# EasyEDA schematic C172-XPNDR-shématics.json
TITLE: Sheet_1; REV: 1.0; Date: 2021-01-01; Sheet: 1/1; Company: Your Company
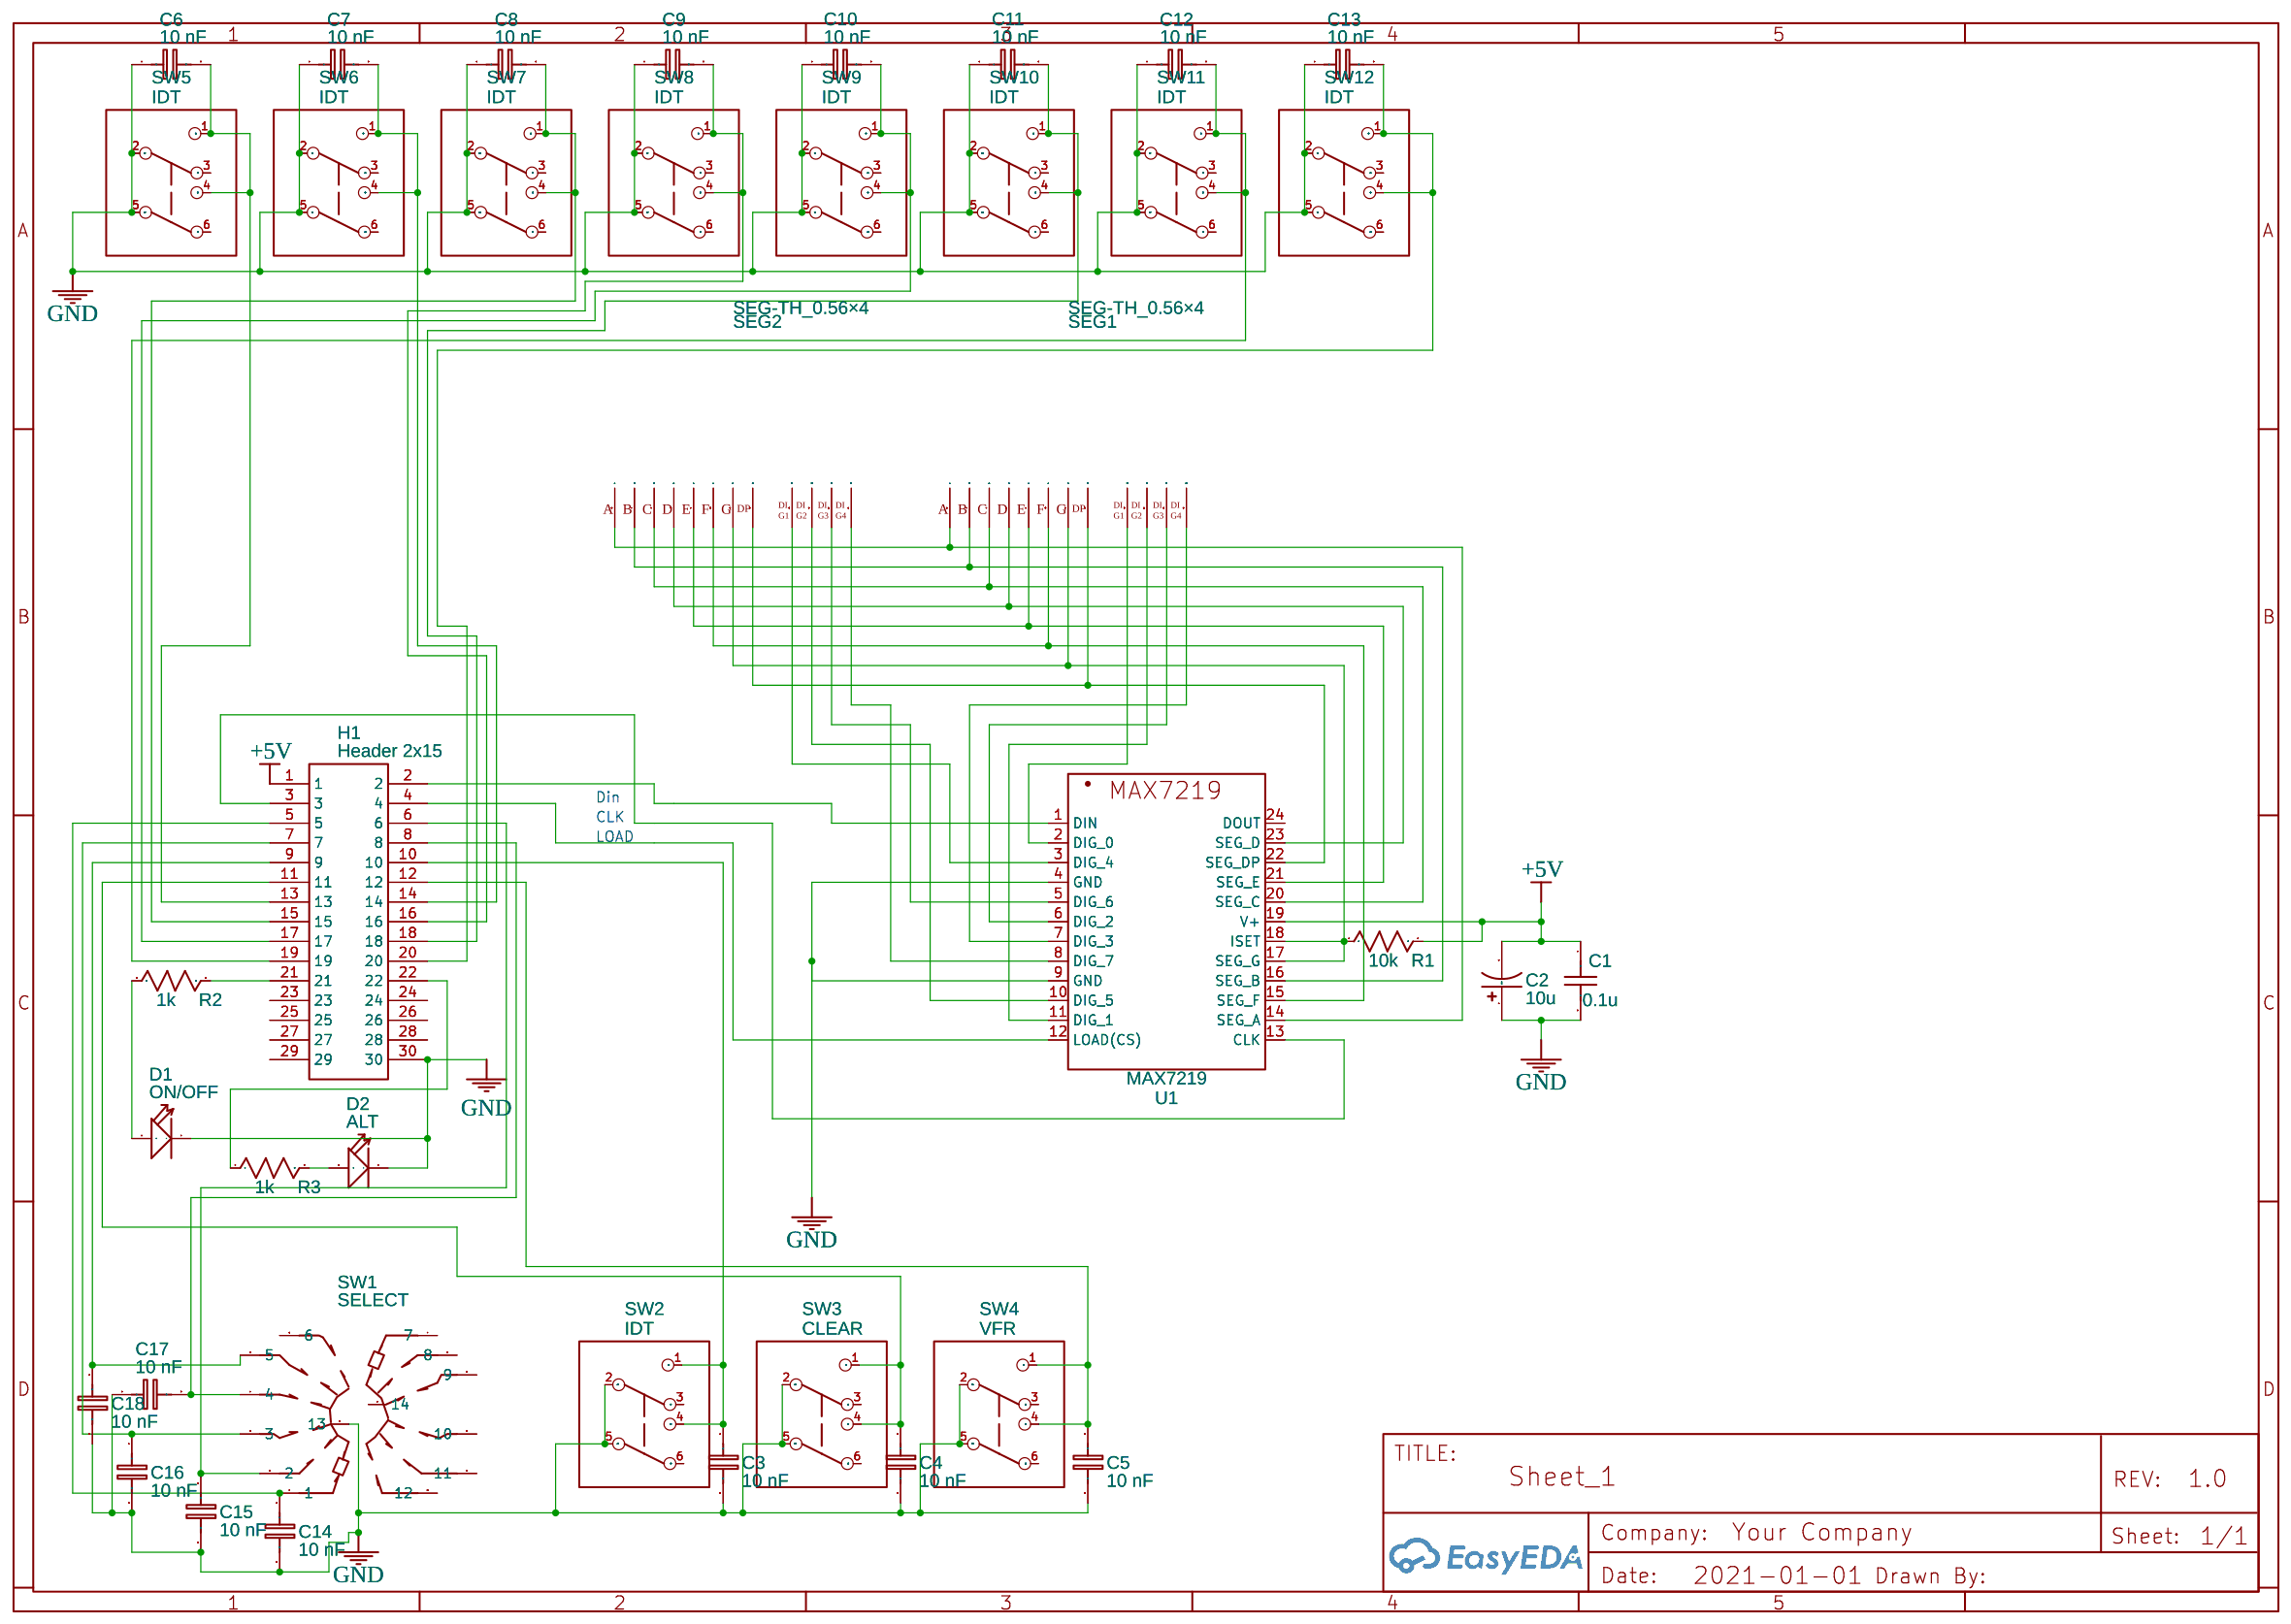
[diagram p0: schematic sheet]

## Parts
C1  0.1u  [CONDENSATEUR]
C2  10u  [CONDENSATEUR]
C3  10 nF  [RAD-0.1]
C4  10 nF  [RAD-0.1]
C5  10 nF  [RAD-0.1]
C6  10 nF  [RAD-0.1]
C7  10 nF  [RAD-0.1]
C8  10 nF  [RAD-0.1]
C9  10 nF  [RAD-0.1]
C10  10 nF  [RAD-0.1]
C11  10 nF  [RAD-0.1]
C12  10 nF  [RAD-0.1]
C13  10 nF  [RAD-0.1]
C14  10 nF  [RAD-0.1]
C15  10 nF  [RAD-0.1]
C16  10 nF  [RAD-0.1]
C17  10 nF  [RAD-0.1]
C18  10 nF  [RAD-0.1]
D1  ON/OFF  [LED2-2.54-D3.0MM]
D2  ALT  [LED2-2.54-D3.0MM]
H1  Header 2x15  [HDR-M-2.54_2X15]
R1  10k  [RESISTANCE]
R2  1k  [RESISTANCE]
R3  1k  [RESISTANCE]
SEG1  SEG-TH_0.56×4  [LED-SEG-TH_12P-L30.0-W14.0-P2.54-S10.16-BL]
SEG2  SEG-TH_0.56×4  [LED-SEG-TH_12P-L30.0-W14.0-P2.54-S10.16-BL]
SW1  SELECT  [LORLIN 2P6T SWITCH]
SW2  IDT  [SW_PUSH_BUTTON_MINI_7X7MM]
SW3  CLEAR  [SW_PUSH_BUTTON_MINI_7X7MM]
SW4  VFR  [SW_PUSH_BUTTON_MINI_7X7MM]
SW5  IDT  [SW_PUSH_BUTTON_MINI_7X7MM]
SW6  IDT  [SW_PUSH_BUTTON_MINI_7X7MM]
SW7  IDT  [SW_PUSH_BUTTON_MINI_7X7MM]
SW8  IDT  [SW_PUSH_BUTTON_MINI_7X7MM]
SW9  IDT  [SW_PUSH_BUTTON_MINI_7X7MM]
SW10  IDT  [SW_PUSH_BUTTON_MINI_7X7MM]
SW11  IDT  [SW_PUSH_BUTTON_MINI_7X7MM]
SW12  IDT  [SW_PUSH_BUTTON_MINI_7X7MM]
U1  MAX7219  [MAX7219_DIP-24]

## Library data of the parts
C1 = C_0201_US: Contributor: LCEDA_Lib
C2 = C_Tan_SMD_A_US: Contributor: LCEDA_Lib
C3-C18 = Capacitor1_EU: Contributor: EasyEDA; Capacitance: 1u; sim: true
D1 D2 = DIP LED Red-Red;: Manufacturer Part: ?
H1 = Header 2x15: link: https://www.aliexpress.com/item/32772785817.html?spm=a2g0s.8937460.0.0.267f2e0enxGmWw; Contributor: darmayuda.b.ariston; Package Display: No
R1-R3 = R_0201_US: Contributor: LCEDA_Lib; Package Display: No
SEG1 SEG2 = SEG-TH_0.56×4: Manufacturer: 方舟 ARKLED; Supplier Part: C109200; Contributor: LCEDA_01
SW1 = LORLIN  2P6T PCB SW: Supplier: Element14; Supplier Part: CK1060; Manufacturer: LORLIN; Manufacturer Part: CK1060; Contributor: junglestar
SW2-SW12 = SW_PUSH_DPDT_MINI_7x7: Contributor: Sikander
U1 = MAX7219: Supplier: LCSC; Manufacturer: DIODES; Manufacturer Part: MAXIM; Supplier Part: C129565; Contributor: phamhai

## Nets
+5V: C1.1 C2.2 H1.1 R1.2 U1.19(V+)
GND: C1.2 C2.1 C3.2 C4.2 C5.2 C6.1 C7.1 C8.1 C9.1 C10.1 C11.1 C12.1 C13.1 C14.2 C15.2 C16.2 C17.1 C18.2 D1.K(-) D2.K(-) H1.30 SW1.13 SW2.2(COM1) SW2.5(COM2) SW3.2(COM1) SW3.5(COM2) SW4.2(COM1) SW4.5(COM2) SW5.2(COM1) SW5.5(COM2) SW6.2(COM1) SW6.5(COM2) SW7.2(COM1) SW7.5(COM2) SW8.2(COM1) SW8.5(COM2) SW9.2(COM1) SW9.5(COM2) SW10.2(COM1) SW10.5(COM2) SW11.2(COM1) SW11.5(COM2) SW12.2(COM1) SW12.5(COM2) U1.4(GND) U1.9(GND)
Net-(C3-1): C3.1 H1.10 SW2.1(NO1) SW2.4(NO2)
Net-(C4-1): C4.1 H1.11 SW3.1(NO1) SW3.4(NO2)
Net-(C5-1): C5.1 H1.12 SW4.1(NO1) SW4.4(NO2)
Net-(C6-2): C6.2 H1.13 SW5.1(NO1) SW5.4(NO2)
Net-(C7-2): C7.2 H1.14 SW6.1(NO1) SW6.4(NO2)
Net-(C8-2): C8.2 H1.15 SW7.1(NO1) SW7.4(NO2)
Net-(C9-2): C9.2 H1.16 SW8.1(NO1) SW8.4(NO2)
Net-(C10-2): C10.2 H1.17 SW9.1(NO1) SW9.4(NO2)
Net-(C11-2): C11.2 H1.18 SW10.1(NO1) SW10.4(NO2)
Net-(C12-2): C12.2 H1.19 SW11.1(NO1) SW11.4(NO2)
Net-(C13-2): C13.2 H1.20 SW12.1(NO1) SW12.4(NO2)
Net-(C14-1): C14.1 H1.5 SW1.1
Net-(C15-1): C15.1 H1.6 SW1.2
Net-(C16-1): C16.1 H1.7 SW1.3
Net-(C17-2): C17.2 H1.8 SW1.4
Net-(C18-1): C18.1 H1.9 SW1.5
Net-(D1-A): D1.A(+) R2.1
Net-(D2-A): D2.A(+) R3.2
Net-(H1-2): H1.2 U1.1(DIN)
Net-(H1-3): H1.3 U1.13(CLK)
Net-(H1-4): H1.4 U1.12(LOAD(CS))
Net-(H1-21): H1.21 R2.2
Net-(H1-22): H1.22 R3.1
Net-(R1-1): R1.1 SEG1.5(G) SEG2.5(G) U1.17(SEG G) U1.18(ISET)
Net-(SEG1-1): SEG1.1(E) SEG2.1(E) U1.21(SEG E)
Net-(SEG1-2): SEG1.2(D) SEG2.2(D) U1.23(SEG D)
Net-(SEG1-3): SEG1.3(DP) SEG2.3(DP) U1.22(SEG DP)
Net-(SEG1-4): SEG1.4(C) SEG2.4(C) U1.20(SEG C)
Net-(SEG1-6): SEG1.6(DIG4) U1.7(DIG 3)
Net-(SEG1-7): SEG1.7(B) SEG2.7(B) U1.16(SEG B)
Net-(SEG1-8): SEG1.8(DIG3) U1.6(DIG 2)
Net-(SEG1-9): SEG1.9(DIG2) U1.11(DIG 1)
Net-(SEG1-10): SEG1.10(F) SEG2.10(F) U1.15(SEG F)
Net-(SEG1-11): SEG1.11(A) SEG2.11(A) U1.14(SEG A)
Net-(SEG1-12): SEG1.12(DIG1) U1.2(DIG 0)
Net-(SEG2-6): SEG2.6(DIG4) U1.8(DIG 7)
Net-(SEG2-8): SEG2.8(DIG3) U1.5(DIG 6)
Net-(SEG2-9): SEG2.9(DIG2) U1.10(DIG 5)
Net-(SEG2-12): SEG2.12(DIG1) U1.3(DIG 4)

Not connected (* = marked no-connect by the designer): H1 23 24 25 26 27 28 29; SW1 6 7 8 9 10 11 12 14; SW2 3(NC1) 6(NC2); SW3 3(NC1) 6(NC2); SW4 3(NC1) 6(NC2); SW5 3(NC1) 6(NC2); SW6 3(NC1) 6(NC2); SW7 3(NC1) 6(NC2); SW8 3(NC1) 6(NC2); SW9 3(NC1) 6(NC2); SW10 3(NC1) 6(NC2); SW11 3(NC1) 6(NC2); SW12 3(NC1) 6(NC2); U1 24(DOUT)

## Notes on the sheet
- Din
- CLK
- LOAD
